# Altium schematic sheet EIT_Teensy_Mux.SchDoc
size A4 portrait
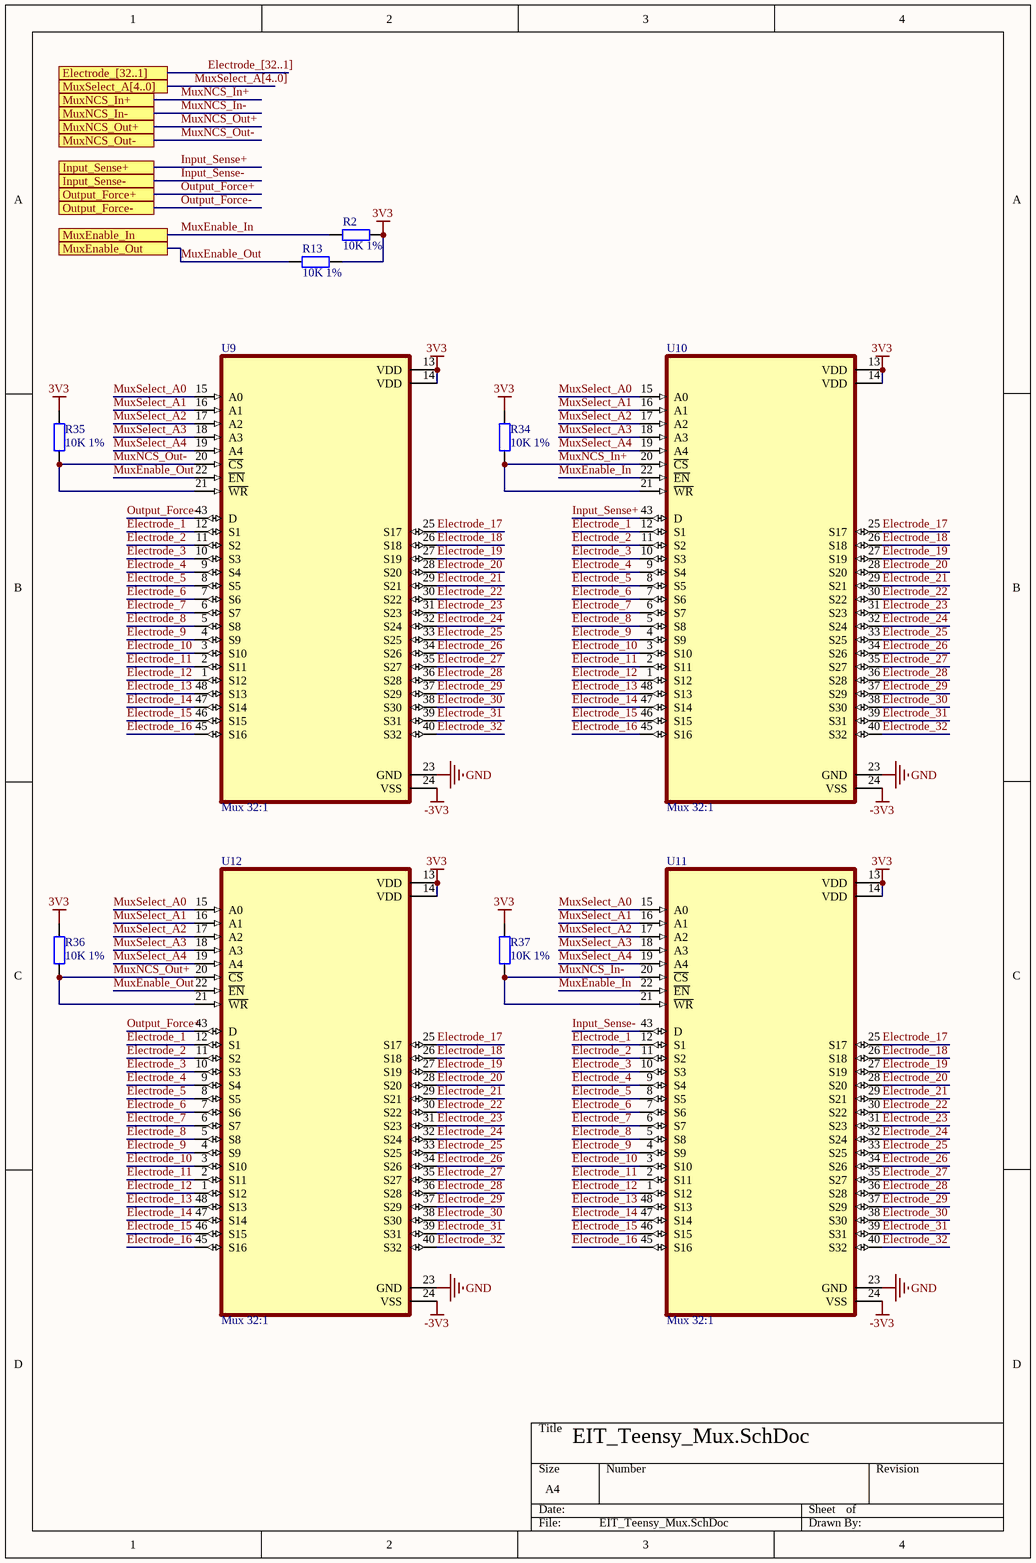
[diagram p0: EIT_Teensy_Mux.SchDoc]

## Parts
R2  10K 1%  [0603 RES]
R13  10K 1%  [0603 RES]
R34  10K 1%  [0603 RES]
R35  10K 1%  [0603 RES]
R36  10K 1%  [0603 RES]
R37  10K 1%  [0603 RES]
U9  Mux 32:1  [QFP50P900X900X120-49N]
U10  Mux 32:1  [QFP50P900X900X120-49N]
U11  Mux 32:1  [QFP50P900X900X120-49N]
U12  Mux 32:1  [QFP50P900X900X120-49N]

## Ports
Electrode_[32..1], Input_Sense+, Input_Sense-, MuxEnable_In, MuxEnable_Out, MuxNCS_In+, MuxNCS_In-, MuxNCS_Out+, MuxNCS_Out-, MuxSelect_A[4..0], Output_Force+, Output_Force-

## Nets
3V3: R2.2 R13.2 R34.2 R35.2 R36.2 R37.2 U9.13(VDD) U9.14(VDD) U10.13(VDD) U10.14(VDD) U11.13(VDD) U11.14(VDD) U12.13(VDD) U12.14(VDD)
-3V3: U9.24(VSS) U10.24(VSS) U11.24(VSS) U12.24(VSS)
GND: U9.23(GND) U10.23(GND) U11.23(GND) U12.23(GND)
Electrode_1: U9.12(S1) U10.12(S1) U11.12(S1) U12.12(S1)
Electrode_2: U9.11(S2) U10.11(S2) U11.11(S2) U12.11(S2)
Electrode_3: U9.10(S3) U10.10(S3) U11.10(S3) U12.10(S3)
Electrode_4: U9.9(S4) U10.9(S4) U11.9(S4) U12.9(S4)
Electrode_5: U9.8(S5) U10.8(S5) U11.8(S5) U12.8(S5)
Electrode_6: U9.7(S6) U10.7(S6) U11.7(S6) U12.7(S6)
Electrode_7: U9.6(S7) U10.6(S7) U11.6(S7) U12.6(S7)
Electrode_8: U9.5(S8) U10.5(S8) U11.5(S8) U12.5(S8)
Electrode_9: U9.4(S9) U10.4(S9) U11.4(S9) U12.4(S9)
Electrode_10: U9.3(S10) U10.3(S10) U11.3(S10) U12.3(S10)
Electrode_11: U9.2(S11) U10.2(S11) U11.2(S11) U12.2(S11)
Electrode_12: U9.1(S12) U10.1(S12) U11.1(S12) U12.1(S12)
Electrode_13: U9.48(S13) U10.48(S13) U11.48(S13) U12.48(S13)
Electrode_14: U9.47(S14) U10.47(S14) U11.47(S14) U12.47(S14)
Electrode_15: U9.46(S15) U10.46(S15) U11.46(S15) U12.46(S15)
Electrode_16: U9.45(S16) U10.45(S16) U11.45(S16) U12.45(S16)
Electrode_17: U9.25(S17) U10.25(S17) U11.25(S17) U12.25(S17)
Electrode_18: U9.26(S18) U10.26(S18) U11.26(S18) U12.26(S18)
Electrode_19: U9.27(S19) U10.27(S19) U11.27(S19) U12.27(S19)
Electrode_20: U9.28(S20) U10.28(S20) U11.28(S20) U12.28(S20)
Electrode_21: U9.29(S21) U10.29(S21) U11.29(S21) U12.29(S21)
Electrode_22: U9.30(S22) U10.30(S22) U11.30(S22) U12.30(S22)
Electrode_23: U9.31(S23) U10.31(S23) U11.31(S23) U12.31(S23)
Electrode_24: U9.32(S24) U10.32(S24) U11.32(S24) U12.32(S24)
Electrode_25: U9.33(S25) U10.33(S25) U11.33(S25) U12.33(S25)
Electrode_26: U9.34(S26) U10.34(S26) U11.34(S26) U12.34(S26)
Electrode_27: U9.35(S27) U10.35(S27) U11.35(S27) U12.35(S27)
Electrode_28: U9.36(S28) U10.36(S28) U11.36(S28) U12.36(S28)
Electrode_29: U9.37(S29) U10.37(S29) U11.37(S29) U12.37(S29)
Electrode_30: U9.38(S30) U10.38(S30) U11.38(S30) U12.38(S30)
Electrode_31: U9.39(S31) U10.39(S31) U11.39(S31) U12.39(S31)
Electrode_32: U9.40(S32) U10.40(S32) U11.40(S32) U12.40(S32)
Input_Sense+: U10.43(D) ; port Input_Sense+
Input_Sense-: U11.43(D) ; port Input_Sense-
MuxEnable_In: R2.1 U10.22(~{EN}) U11.22(~{EN}) ; port MuxEnable_In
MuxEnable_Out: R13.1 U9.22(~{EN}) U12.22(~{EN}) ; port MuxEnable_Out
MuxNCS_In+: R34.1 U10.20(~{CS}) U10.21(~{WR}) ; port MuxNCS_In+
MuxNCS_In-: R37.1 U11.20(~{CS}) U11.21(~{WR}) ; port MuxNCS_In-
MuxNCS_Out+: R36.1 U12.20(~{CS}) U12.21(~{WR}) ; port MuxNCS_Out+
MuxNCS_Out-: R35.1 U9.20(~{CS}) U9.21(~{WR}) ; port MuxNCS_Out-
MuxSelect_A0: U9.15(A0) U10.15(A0) U11.15(A0) U12.15(A0)
MuxSelect_A1: U9.16(A1) U10.16(A1) U11.16(A1) U12.16(A1)
MuxSelect_A2: U9.17(A2) U10.17(A2) U11.17(A2) U12.17(A2)
MuxSelect_A3: U9.18(A3) U10.18(A3) U11.18(A3) U12.18(A3)
MuxSelect_A4: U9.19(A4) U10.19(A4) U11.19(A4) U12.19(A4)
Output_Force+: U12.43(D) ; port Output_Force+
Output_Force-: U9.43(D) ; port Output_Force-

## Buses and harness runs
bus Electrode_[32..1] = port Electrode_[32..1]
bus MuxSelect_A[4..0] = port MuxSelect_A[4..0]

## Library data of the parts
R2 R13 R34-R37 = Res 0603 10K 1%: Res General Purpose Thick Film 0603 10K Ohm 1% 1/10W ±100ppm/°C Molded SMD Paper T/R; Manufacturer: Yageo; Manufacturer Part Number: RC0603FR-0710KL; Voltage Rating: 75V; Resistance: 10kR; Power Rating: 100mW; Voltage Rating (DC): 50V; Supplier 1: Digi-Key; RoHS: Yes; Category: Chip SMD Resistors; Stock 1: 18430741; Pricing 1: 1=0.10000, 10=0.02400, 100=0.00970, 1000=0.00436, 2500=0.00378 (USD); Case/Package: 0603; Number of Pins: 2; Case Code (Imperial): 0603; Case Code (Metric): 1608; Size Code: 0603; Weight: 7.1E-05oz; Min Operating Temperature: -55°C; Max Operating Temperature: 155°C; Packaging: Tape and Reel; Tolerance: 1%; Termination: SMD/SMT; Resistor Type: Thick Film; Temperature Coefficient: 100ppm/°C; Features: Moisture Resistant; Series: RC; Max Power Dissipation: 100mW; Number of Terminations: 2; Resistance Tolerance: 1%; Construction: Rectangular; Length: 1.6mm; Width: 0.8mm; Height: 0.45mm; Depth: 0.8mm; Lead Pitch: 0.3mm; REACH SVHC: Unknown; Military Standard: Not; Lead Free: Lead Free; RoHS Compliant: Yes; ComponentLink1URL: https://datasheet.ciiva.com/15189/getdatasheetpartid-409289-15189591.pdf?src-supplier=Verical; ComponentLink1Description: https://datasheet.ciiva.com/15189/getdatasheetpartid-409289-15189591.pdf?src-supplier=Verical; ComponentLink2URL: https://datasheet.ciiva.com/7660/38590-7660789.pdf?src-supplier=Element14; ComponentLink2Description: https://datasheet.ciiva.com/7660/38590-7660789.pdf?src-supplier=Element14; ComponentLink3URL: https://datasheet.ciiva.com/7746/1738695-7746239.pdf?src-supplier=Element14; ComponentLink3Description: https://datasheet.ciiva.com/7746/1738695-7746239.pdf?src-supplier=Element14; ComponentLink4URL: https://datasheet.ciiva.com/7983/443971-7983596.pdf?src-supplier=Element14; ComponentLink4Description: https://datasheet.ciiva.com/7983/443971-7983596.pdf?src-supplier=Element14; ComponentLink5URL: https://datasheet.ciiva.com/22747/443971-22747519.pdf?src-supplier=Element14; ComponentLink5Description: https://datasheet.ciiva.com/22747/443971-22747519.pdf?src-supplier=Element14; ComponentLink6URL: https://datasheet.ciiva.com/46440/1868787-46440891.pdf?src-supplier=Element14; ComponentLink6Description: https://datasheet.ciiva.com/46440/1868787-46440891.pdf?src-supplier=Element14; Supplier Part Number 1: 311-10.0KHRCT-ND
U9-U12 = Mux ADG732BSUZ: Analog Multiplexer Single 32:1 48-Pin TQFP T/R; Manufacturer: Analog Devices; Manufacturer Part Number: ADG732BSUZ-REEL; Min Supply Voltage: 1.8V; Max Supply Voltage: 5.5V; Number of Inputs: 32; Number of Outputs: 1; Operating Supply Voltage: 5V; Dual Supply Voltage: 2.5V; Bandwidth: 18MHz; Max Power Dissipation: 100uW; On-State Resistance: 5.5R; Operating Supply Current: 10uA; Turn-Off Delay Time: 16ns; Supply Type: Single,Dual; Interface: Parallel; Supplier 1: Digi-Key; RoHS: Yes; Category: Interface ICs; Stock 1: 3425; Pricing 1: 1=12.59000, 10=11.37200, 25=10.84320, 100=9.41510, 250=8.99200, 500=8.19856, 1000=7.48500 (USD); Case/Package: TQFP; Number of Pins: 48; Min Operating Temperature: -40°C; Max Operating Temperature: 85°C; Number of Channels: 32; Package Quantity: 2000; Packaging: Tape and Reel; Number of Circuits: 1; -3db Bandwidth: 18MHz; Logic Function: Multiplexer; Series: -; Lead Free: Contains Lead; RoHS Compliant: Yes; ComponentLink1URL: https://datasheet.ciiva.com/26824/adg732bsuz-reel-26824926.pdf?src-supplier=IIIC; ComponentLink1Description: https://datasheet.ciiva.com/26824/adg732bsuz-reel-26824926.pdf?src-supplier=IIIC; ComponentLink2URL: https://datasheet.ciiva.com/16637/adg726-732-16637530.pdf?src-supplier=Avnet+Europe; ComponentLink2Description: https://datasheet.ciiva.com/16637/adg726-732-16637530.pdf?src-supplier=Avnet+Europe; Supplier Part Number 1: ADG732BSUZ-REELCT-ND